# EAGLE schematic TinyCube14_FourLayerABC (EAGLE 7.5.0)

## Sheet 1 of 2
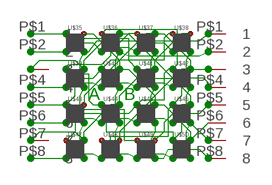
[diagram p0: schematic, sheet 1]

### Parts
U$35  PILLAR  [10MIL]
U$36  PILLAR  [10MIL]
U$37  PILLAR  [10MIL]
U$38  PILLAR  [10MIL]
U$39  PILLAR  [10MIL]
U$40  PILLAR  [10MIL]
U$41  PILLAR  [10MIL]
U$42  PILLAR  [10MIL]
U$43  PILLAR  [10MIL]
U$44  PILLAR  [10MIL]
U$45  PILLAR  [10MIL]
U$46  PILLAR  [10MIL]
U$47  PILLAR  [10MIL]
U$48  PILLAR  [10MIL]
U$49  PILLAR  [10MIL]
U$50  PILLAR  [10MIL]
U$51  TINY_HEADER_DEV  [TINY_HEADER_PKG]
U$52  TINY_HEADER_DEV  [TINY_HEADER_PKG]

### Nets
N$1: U$35.R(B) U$41.R(B) U$46.R(B) U$48.R(B) U$51.P$1
N$7: U$35.+(G) U$40.+(G) U$45.+(G) U$50.+(G) U$52.P$6
N$8: U$36.R(B) U$42.R(B) U$45.R(B) U$47.R(B) U$52.P$4
N$9: U$35.G(A) U$36.G(A) U$37.G(A) U$38.G(A) U$51.P$2
N$10: U$39.G(A) U$40.G(A) U$41.G(A) U$42.G(A) U$51.P$4
N$11: U$43.G(A) U$44.G(A) U$45.G(A) U$46.G(A) U$51.P$6
N$12: U$47.G(A) U$48.G(A) U$49.G(A) U$50.G(A) U$51.P$8
N$13: U$35.B(R) U$39.B(R) U$43.B(R) U$47.B(R) U$52.P$1
N$14: U$38.R(B) U$40.R(B) U$43.R(B) U$49.R(B) U$51.P$5
N$15: U$37.B(R) U$41.B(R) U$45.B(R) U$49.B(R) U$52.P$8
N$16: U$38.B(R) U$42.B(R) U$46.B(R) U$50.B(R) U$52.P$7
N$17: U$36.B(R) U$40.B(R) U$44.B(R) U$48.B(R) U$52.P$2
N$18: U$36.+(G) U$39.+(G) U$46.+(G) U$49.+(G) U$51.P$3
N$19: U$37.+(G) U$42.+(G) U$43.+(G) U$48.+(G) U$52.P$3
N$21: U$38.+(G) U$41.+(G) U$44.+(G) U$47.+(G) U$51.P$7
N$22: U$37.R(B) U$39.R(B) U$44.R(B) U$50.R(B) U$52.P$5

### Notes on the sheet
- A | B

## Sheet 2 of 2

## Library data of the parts
U$35-U$50 = PILLAR:PILLAR
U$51 U$52 = TinyHeader:TINY_HEADER_DEV